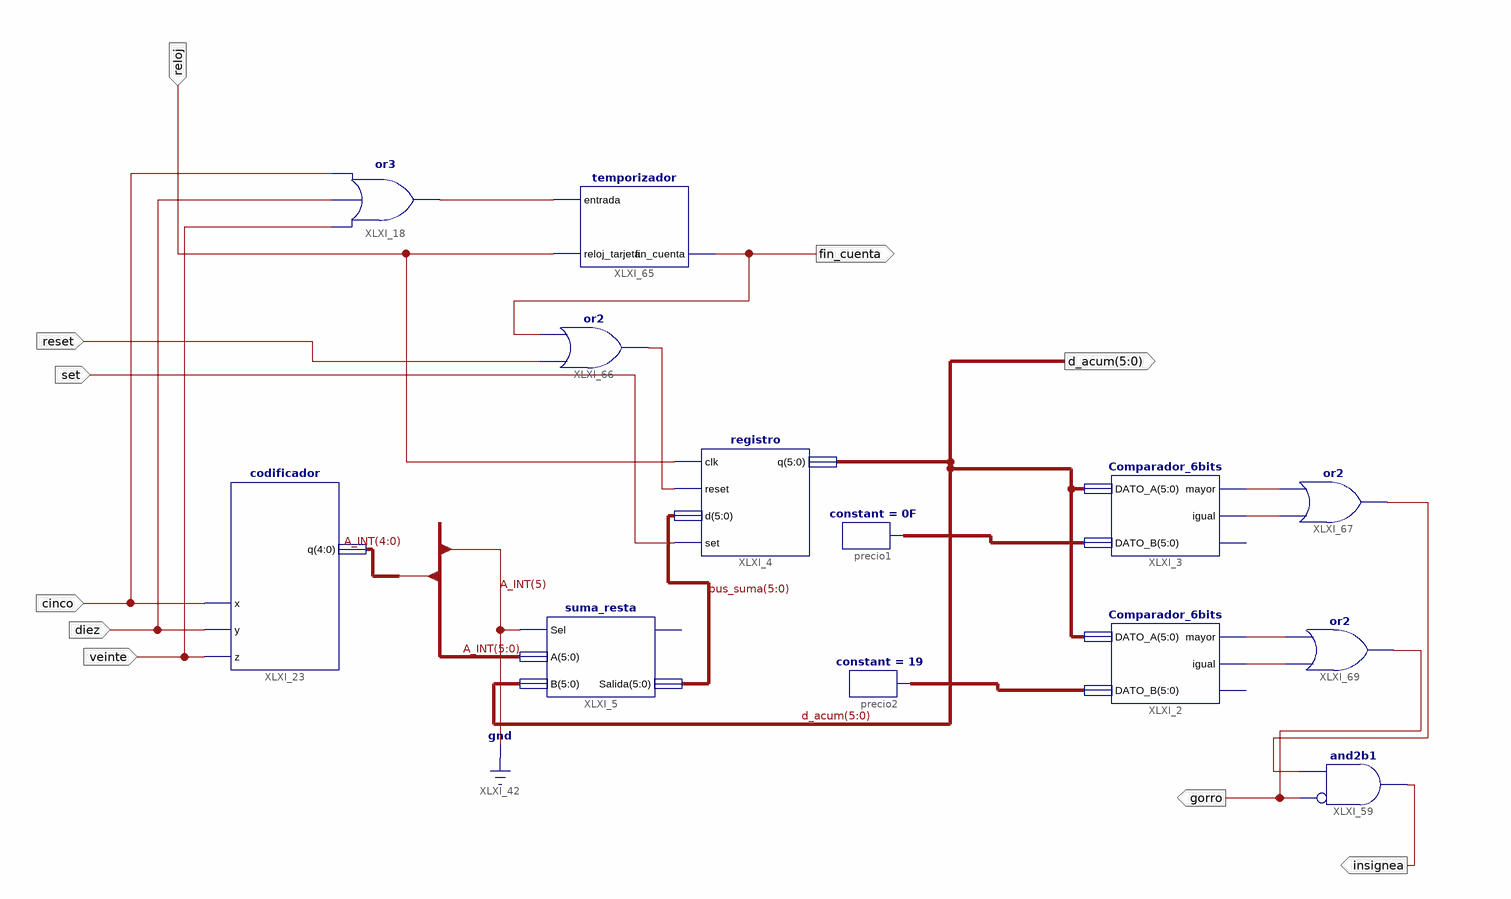
[diagram p0: schematic sheet 1]
// Xilinx ISE schematic unidad_de_proceso.sch (spartan6) as structural Verilog: 13 symbols, 10 ports
module unidad_de_proceso (
  input  cinco,
  input  diez,
  input  veinte,
  input  set,
  input  reset,
  input  reloj,
  output [5:0] d_acum,
  output gorro,
  output insignea,
  output fin_cuenta
);

  wire XLXN_77, XLXN_78, XLXN_81, XLXN_82, XLXN_83, XLXN_86, XLXN_94;
  wire [4:0] A_INT;
  wire [5:0] bus_suma, precio_a, precio_b;

  registro XLXI_4 (.clk(reloj), .reset(XLXN_86), .set(set), .d(bus_suma), .q(d_acum));
  suma_resta XLXI_5 (.Sel(1'b0), .A({1'b0, A_INT}), .B(d_acum), .Salida(bus_suma));  // open: Cout
  or XLXI_18 (XLXN_94, veinte, diez, cinco);
  codificador XLXI_23 (.x(cinco), .y(diez), .z(veinte), .q(A_INT));
  Comparador_6bits XLXI_2 (.DATO_A(d_acum), .DATO_B(precio_b), .mayor(XLXN_81), .igual(XLXN_82));  // open: menor
  Comparador_6bits XLXI_3 (.DATO_A(d_acum), .DATO_B(precio_a), .mayor(XLXN_77), .igual(XLXN_78));  // open: menor
  constant #(.CValue("0F")) precio1 (.O(precio_a));
  constant #(.CValue("19")) precio2 (.O(precio_b));
  and XLXI_59 (insignea, ~gorro, XLXN_83);  // and2b1
  temporizador XLXI_65 (.entrada(XLXN_94), .reloj_tarjeta(reloj), .fin_cuenta(fin_cuenta));
  or XLXI_66 (XLXN_86, reset, fin_cuenta);
  or XLXI_67 (XLXN_83, XLXN_78, XLXN_77);
  or XLXI_69 (gorro, XLXN_82, XLXN_81);
endmodule
